# Altium schematic sheet SchemaBloc.SchDoc: Localisation sous marine
size A4; Author: Ali Zoubir; DrawnBy: Ali Zoubir; Engineer: Ali Zoubir; Organization: ETML-ES; Revision: 0.0; SheetNumber: 1; SheetTotal: 6
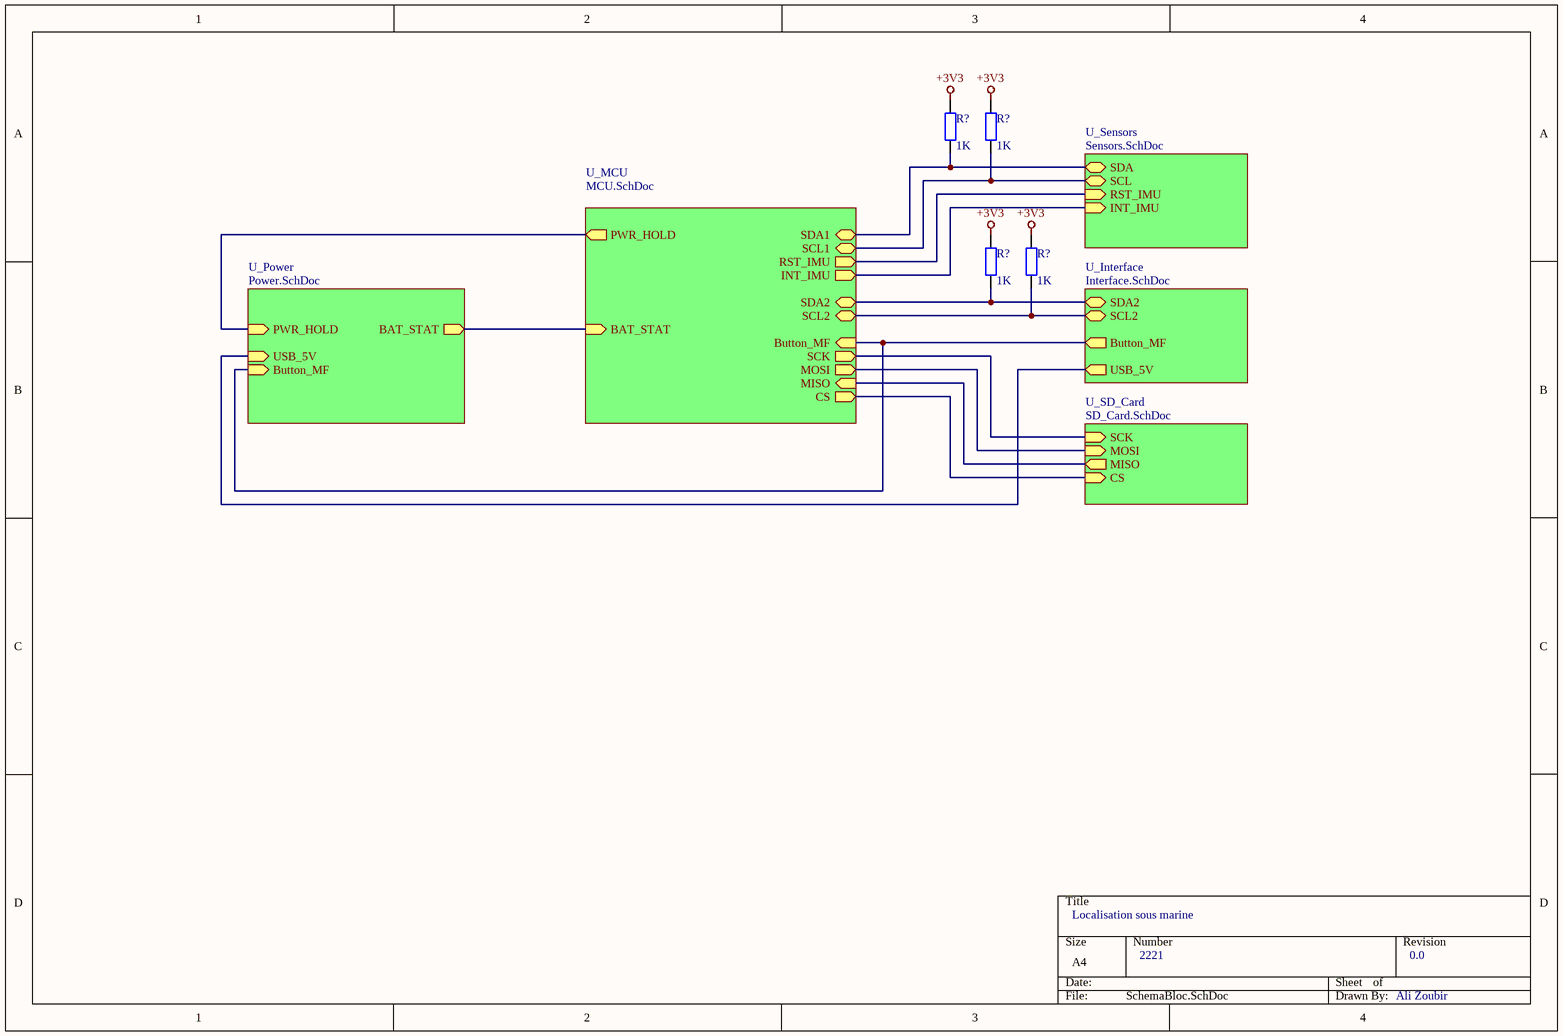
[diagram p0: SchemaBloc.SchDoc]

## Parts
(Parts that share a designator on the sheet are numbered #1, #2 ... from top to bottom, then left to right.)
R?#1  value 1K  [AXIAL-0.4]
R?#2  value 1K  [AXIAL-0.4]
R?#3  value 1K  [AXIAL-0.4]
R?#4  value 1K  [AXIAL-0.4]

## Sub-sheets
U_Interface = Interface.SchDoc: SDA2 (bidir), SCL2 (bidir), Button_MF (out), USB_5V (out)
U_MCU = MCU.SchDoc: SDA1 (bidir), SCL1 (bidir), Button_MF (in), SCK (out), MOSI (out), MISO (in), CS (out), BAT_STAT (in), RST_IMU (out), INT_IMU (out), PWR_HOLD (out), SDA2 (bidir), SCL2 (bidir)
U_Power = Power.SchDoc: BAT_STAT (out), PWR_HOLD (in), Button_MF (in), USB_5V (in)
U_SD_Card = SD_Card.SchDoc: SCK (in), MOSI (in), MISO (out), CS (in)
U_Sensors = Sensors.SchDoc: SDA (bidir), SCL (bidir), RST_IMU (in), INT_IMU (in)

## Nets
+3V3: R?#1.2 R?#2.2 R?#3.2 R?#4.2
NetR?#1_1: R?#1.1 ; sheet U_MCU/SDA1, sheet U_Sensors/SDA
NetR?#2_1: R?#2.1 ; sheet U_MCU/SCL1, sheet U_Sensors/SCL
NetR?#3_1: R?#3.1 ; sheet U_MCU/SDA2, sheet U_Interface/SDA2
NetR?#4_1: R?#4.1 ; sheet U_MCU/SCL2, sheet U_Interface/SCL2
(unnamed): sheet U_MCU/Button_MF, sheet U_Interface/Button_MF, sheet U_Power/Button_MF
(unnamed): sheet U_MCU/SCK, sheet U_SD_Card/SCK
(unnamed): sheet U_MCU/MOSI, sheet U_SD_Card/MOSI
(unnamed): sheet U_MCU/MISO, sheet U_SD_Card/MISO
(unnamed): sheet U_MCU/CS, sheet U_SD_Card/CS
(unnamed): sheet U_MCU/BAT_STAT, sheet U_Power/BAT_STAT
(unnamed): sheet U_MCU/RST_IMU, sheet U_Sensors/RST_IMU
(unnamed): sheet U_MCU/INT_IMU, sheet U_Sensors/INT_IMU
(unnamed): sheet U_MCU/PWR_HOLD, sheet U_Power/PWR_HOLD
(unnamed): sheet U_Interface/USB_5V, sheet U_Power/USB_5V

## Notes on the sheet
- 2221

## Library data of the parts
R?#1-R?#4 = Res2: Resistor; Published: 8-Jun-2000; LatestRevisionDate: 17-Jul-2002; LatestRevisionNote: Re-released for DXP Platform.; PackageReference: AXIAL-0.4; Publisher: Altium Limited; PackageDescription: Axial Device, Thru-Hole; 2 Leads; 0.4 in Pin Spacing